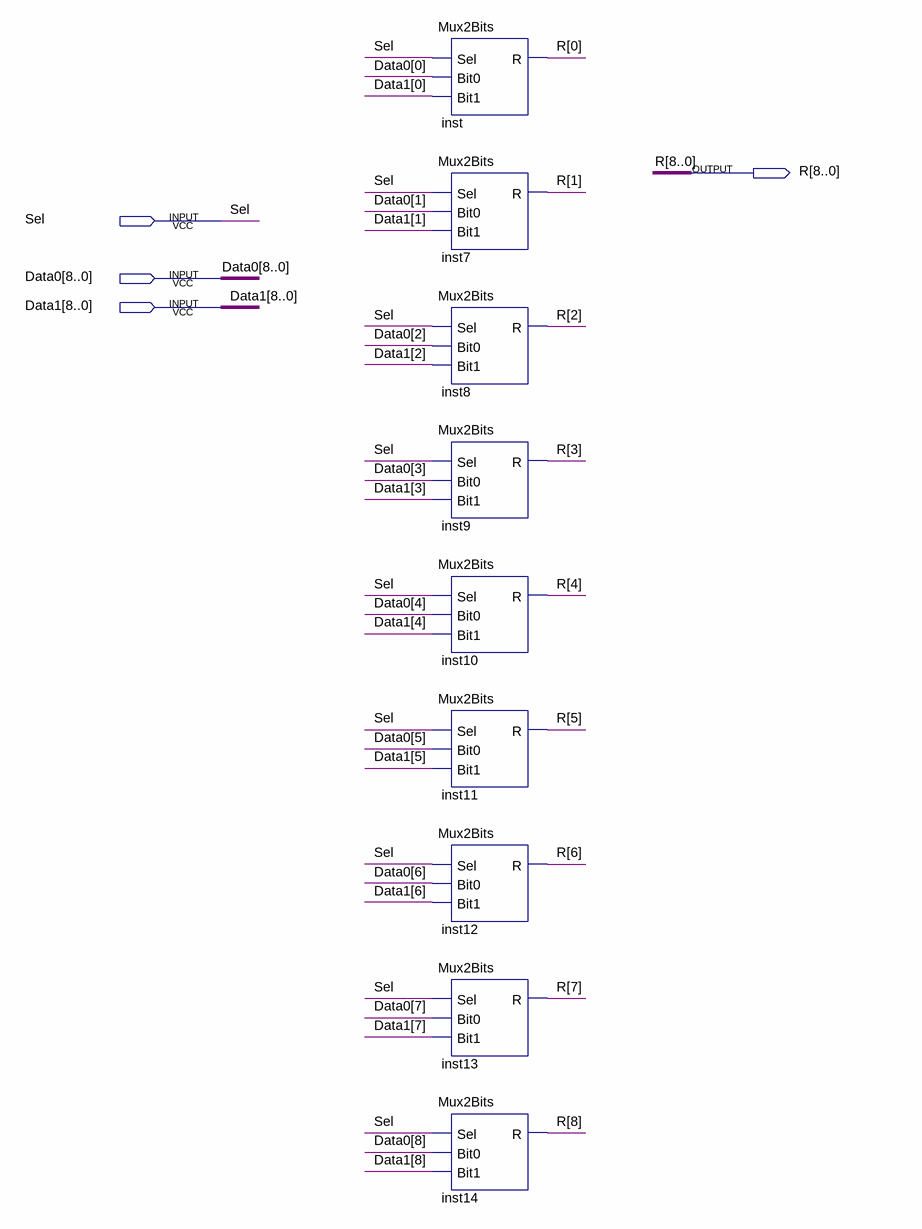
[diagram p0: schematic sheet]
// Quartus schematic Mux2Barramentos.bdf as structural Verilog: 9 symbols, 4 pins
module Mux2Barramentos (
  input  Sel,
  input  [8:0] Data0,
  input  [8:0] Data1,
  output [8:0] R
);

  Mux2Bits inst (.Sel(Sel), .Bit0(Data0[0]), .Bit1(Data1[0]), .R(R[0]));
  Mux2Bits inst7 (.Sel(Sel), .Bit0(Data0[1]), .Bit1(Data1[1]), .R(R[1]));
  Mux2Bits inst8 (.Sel(Sel), .Bit0(Data0[2]), .Bit1(Data1[2]), .R(R[2]));
  Mux2Bits inst9 (.Sel(Sel), .Bit0(Data0[3]), .Bit1(Data1[3]), .R(R[3]));
  Mux2Bits inst10 (.Sel(Sel), .Bit0(Data0[4]), .Bit1(Data1[4]), .R(R[4]));
  Mux2Bits inst11 (.Sel(Sel), .Bit0(Data0[5]), .Bit1(Data1[5]), .R(R[5]));
  Mux2Bits inst12 (.Sel(Sel), .Bit0(Data0[6]), .Bit1(Data1[6]), .R(R[6]));
  Mux2Bits inst13 (.Sel(Sel), .Bit0(Data0[7]), .Bit1(Data1[7]), .R(R[7]));
  Mux2Bits inst14 (.Sel(Sel), .Bit0(Data0[8]), .Bit1(Data1[8]), .R(R[8]));
endmodule
